# Altium schematic sheet Raspberry_Pi4.SchDoc
size A4; SheetNumber: 3; SheetTotal: 3
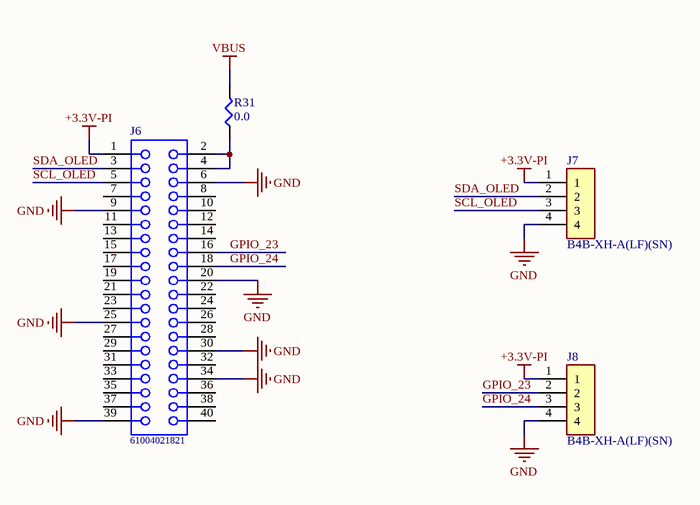
[diagram p0: Raspberry_Pi4.SchDoc]

## Parts
J6  61004021821  [61004021821]
J7  B4B-XH-A(LF)(SN)  [JST_B4B-XH-A(LF)(SN)]
J8  B4B-XH-A(LF)(SN)  [JST_B4B-XH-A(LF)(SN)]
R31  0.0  [SMD-0402-RES]

## Nets
+3.3V-PI: J6.1 J7.1 J8.1
GND: J6.6 J6.9 J6.20 J6.25 J6.30 J6.34 J6.39 J7.4 J8.4
VBUS: R31.2
GPIO_23: J6.16 J8.2
GPIO_24: J6.18 J8.3
SCL_OLED: J6.5 J7.3
SDA_OLED: J6.3 J7.2
NetJ6_2: J6.2 J6.4 R31.1

Not connected (* = marked no-connect by the designer): J6 7 8 10 11 12 13 14 15 17 19 21 22 23 24 26 27 28 29 31 32 33 35 36 37 38 40

## Library data of the parts
J6 = 61004021821: WR-PHD Socket Header, SMT, pitch 2.54mm, Dual Row, Vertical, 40p; Manufacturer: Wurth Elektronik; Pin Number: 40; Rated Current: 3A; Working Voltage: 250VAC; Withstanding Voltage: 600VAC; Contact Resistance: 20mOhm; ComponentLink1Description: Manufacturer; ComponentLink1URL: http://www.we-online.de; ComponentLink2Description: Datasheet; ComponentLink2URL: https://www.we-online.com/catalog/datasheet/61004021821.pdf; Manufacturer Part Number: 61004021821; Published Date: May 2020; Pitch: 2.54mm; Operating Temperature: -40 to +105degC; Mounting Technology: SMT; Packaging: Tube; Gender: Socket Header; Row Number: Dual; Orientation: Vertical
J7 J8 = B4B-XH-A(LF)(SN): Connector Header Through Hole 4 position 0.098 (2.50mm); MF: JST Sales; Check_prices: https://www.snapeda.com/parts/B4B-XH-A(LF)(SN)/JST%20Sales%20America%20Inc./view-part/447494/?ref=eda; Purchase-URL: https://pricing.snapeda.com/search/part/B4B-XH-A(LF)(SN)/?ref=eda; SnapEDA_Link: https://www.snapeda.com/parts/B4B-XH-A(LF)(SN)/JST%20Sales%20America%20Inc./view-part/447494/?ref=snap; Price: None; Value: *; MP: B4B-XH-A(LF)(SN); Package: None; Availability: Warning
R31 = ERJ-2GE0R00X: RES SMD 0.0OHM JUMPER 1/10W 0402; Manufacturer: Panasonic Electronic Components; Factory Stock: 0; Unit Price (USD): 0.00384; @ qty: 1500; Minimum Quantity: 1; Power (Watts): 0.1W, 1/10W; Part Number: ERJ-2GE0R00X; Datasheets: http://industrial.panasonic.com/www-cgi/jvcr13pz.cgi?E+PZ+3+AOA0001+ERJ2GE0R00X+7+WW; Image: //media.digikey.com/Photos/Panasonic%20Photos/ERJ-PA2-Series.jpg; Digi-Key Part Number: P0.0JCT-ND; Quantity Available: 3152483; Packaging: Cut Tape (CT); Series: ERJ; Part Status: Active; Value: 0.0; Tolerance: Jumper; Composition: Thick Film; Features: Automotive AEC-Q200; Temperature Coefficient: -; Operating Temperature: -55°C ~ 155°C; Package / Case: 0402 (1005 Metric); Supplier Device Package: 0402; Size / Dimension: 0.039" L x 0.020" W (1.00mm x 0.50mm); Height - Seated (Max): 0.016" (0.40mm); Number of Terminations: 2; Failure Rate: -